# EAGLE design Root1 CR2032 Power Module (EAGLE 6.2)
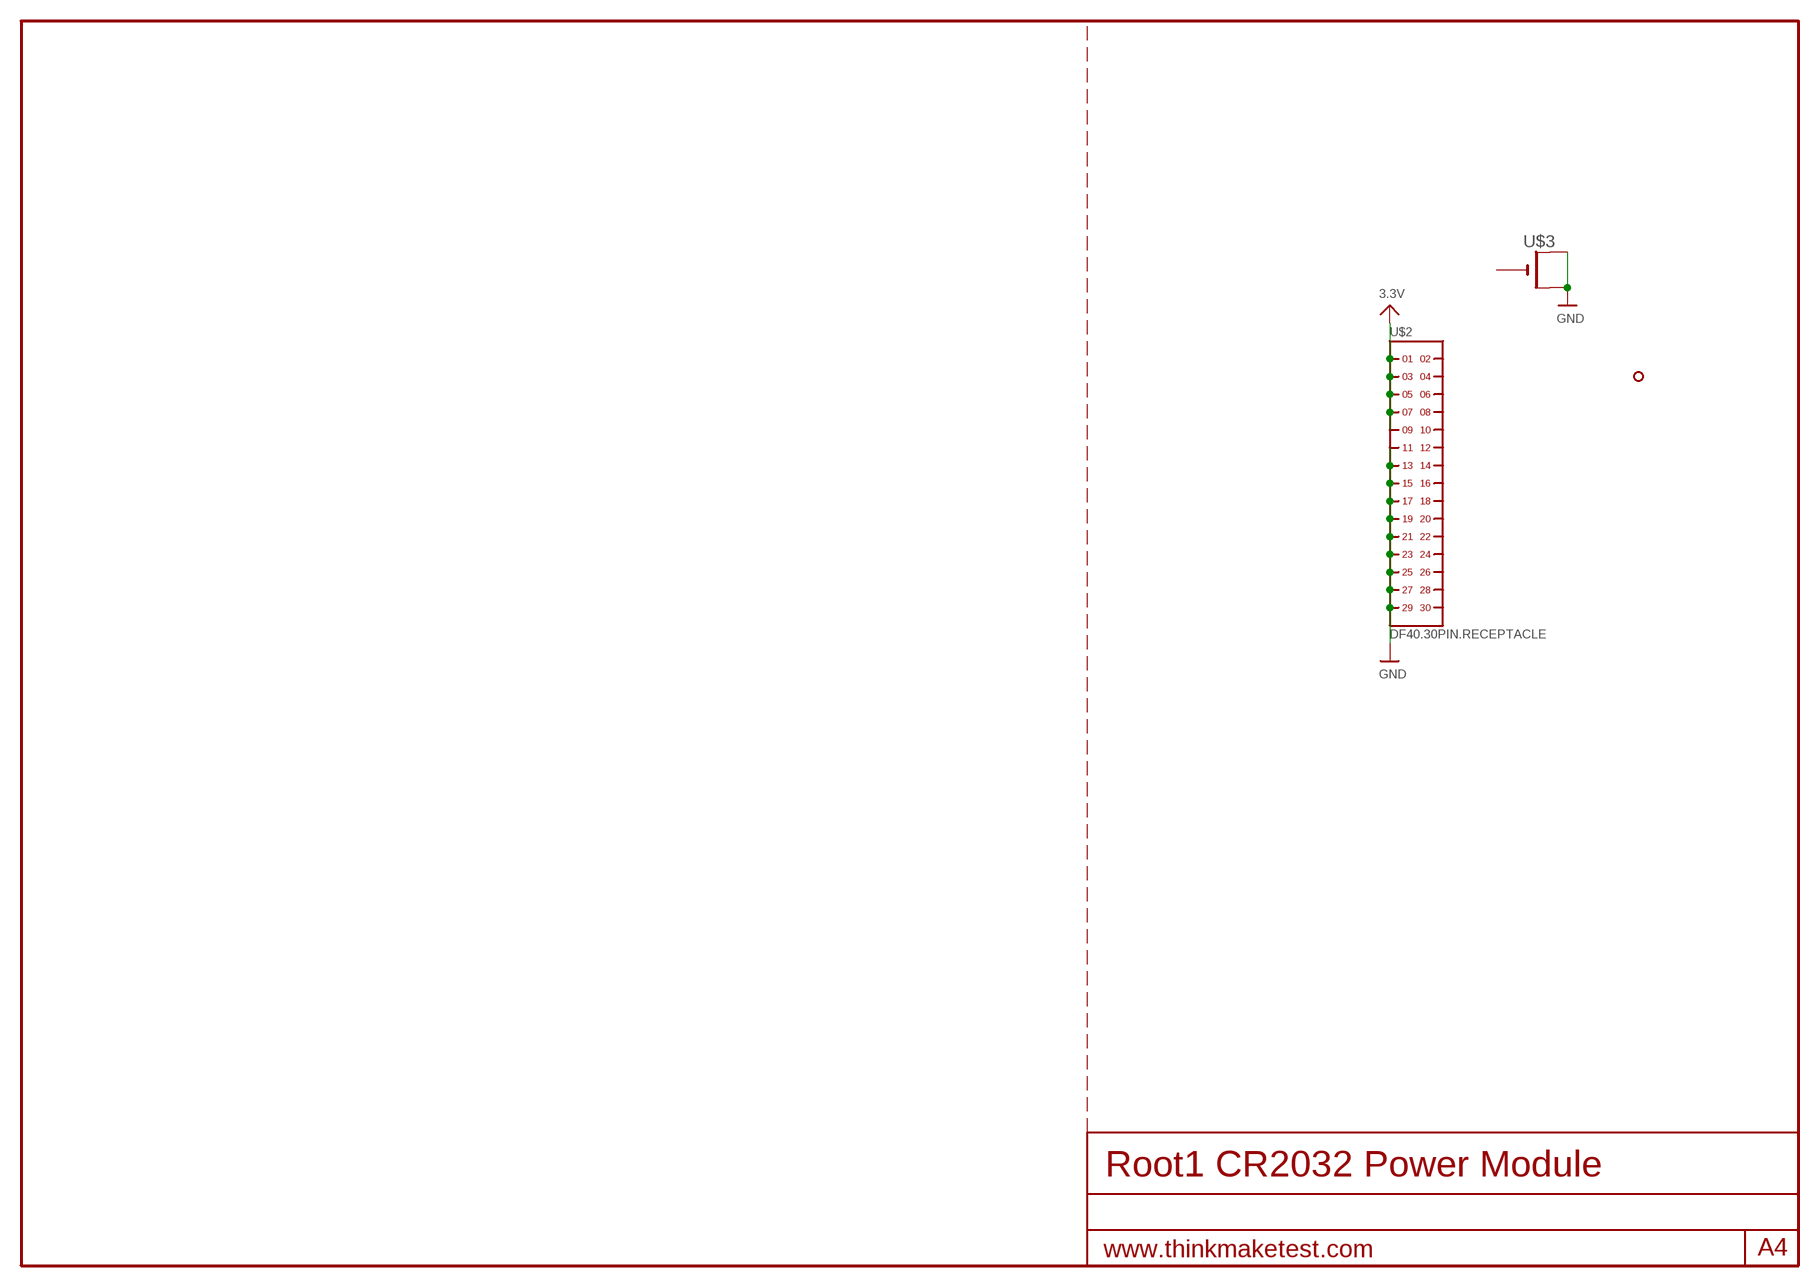
[diagram p0: schematic, sheet 1]

## Parts
U$2  DF40.30PIN.RECEPTACLE  [DF40(XX)-30DS-0.4V]
U$3  CR2032THM  [CR2032-THRU]
U$4  HOLE.4MM  [4MM]

## Nets
3.3V: U$2.1 U$2.3 U$2.5 U$2.7 U$2.9
GND: U$2.11 U$2.13 U$2.15 U$2.17 U$2.19 U$2.21 U$2.23 U$2.25 U$2.27 U$2.29 U$3.+1(+) U$3.+2(+1)
Unconnected: U$2.2 U$2.4 U$2.6 U$2.8 U$2.10 U$2.12 U$2.14 U$2.16 U$2.18 U$2.20 U$2.22 U$2.24 U$2.26 U$2.28 U$2.30 U$3.-

## Library data of the parts
U$2 = hirose:DF40.30PIN
U$3 = adafruit:CR2032
U$4 = .screw_holes:HOLE

## Board
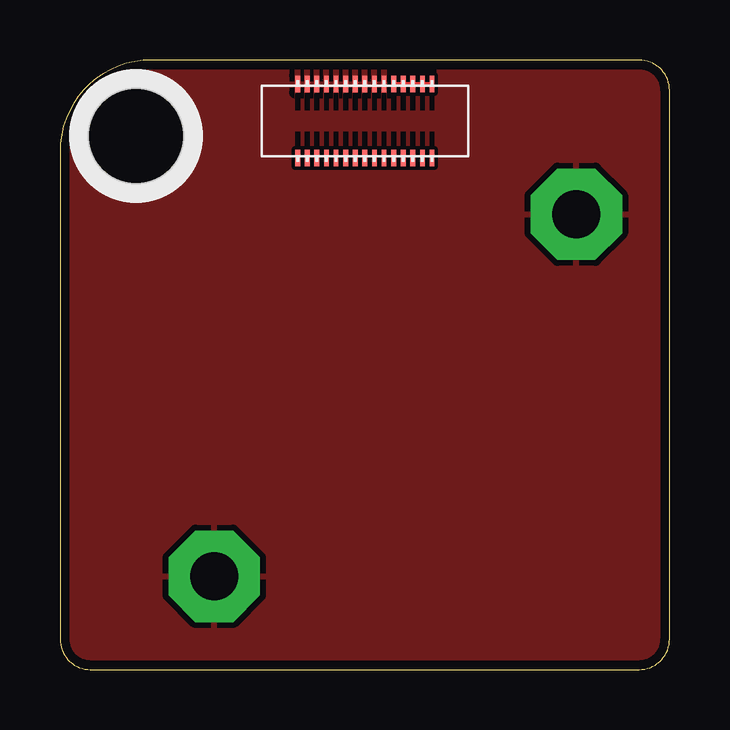
[diagram p1: board, top side]
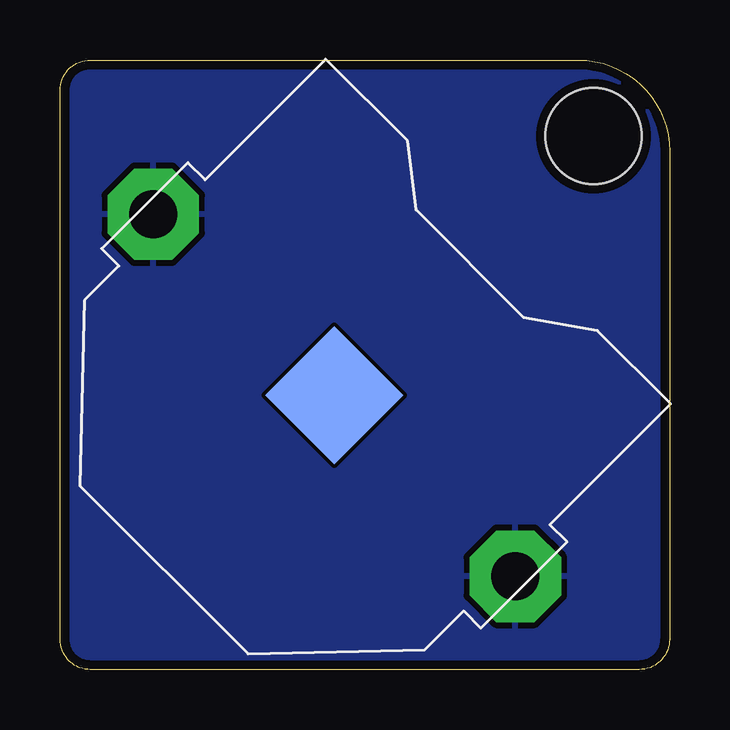
[diagram p2: board, bottom side, seen from below]

Size 25.4 x 25.4 mm. Coordinates in mm from the lower left corner, seen from the top.
Outline: 24.13,25.4 3.81,25.4 arc90 0,21.59 0,1.27 arc90 1.27,0 24.13,0 arc90 25.4,1.27 25.4,24.13 arc90 24.13,25.4
Copper layers (1*16): Top 0.0356mm / dielectric 1.5011mm / Bottom 0.0356mm
Design rules: minimum track width 6mil, minimum drill 13mil, track to track 6mil, track to pad 6mil, pad to pad 6mil, via to via 6mil, smd to smd 6mil, copper to edge 15mil, drill to drill 6mil, minimum pad ring 7mil, minimum via ring 7mil, stop-mask expansion 4mil, vias tented up to drill 16mil, thermal gap 10mil

### Footprints (pad centres in the part's own frame; a part is rotated, then mirrored left to right if it is on the bottom)
DF40(XX)-30DS-0.4V = smd 0.2 x 0.7: 1 -2.8,-1.54; 2 -2.8,1.54; 3 -2.4,-1.54; 4 -2.4,1.54; 5 -2,-1.54; 6 -2,1.54; 7 -1.6,-1.54; 8 -1.6,1.54; 9 -1.2,-1.54; 10 -1.2,1.54; 11 -0.8,-1.54; 12 -0.8,1.54; 13 -0.4,-1.54; 14 -0.4,1.54; 15 0,-1.54; 16 0,1.54; 17 0.4,-1.54; 18 0.4,1.54; 19 0.8,-1.54; 20 0.8,1.54; 21 1.2,-1.54; 22 1.2,1.54; 23 1.6,-1.54; 24 1.6,1.54; 25 2,-1.54; 26 2,1.54; 27 2.4,-1.54; 28 2.4,1.54; 29 2.8,-1.54; 30 2.8,1.54
CR2032-THRU = drill 2 pad 3.81 octagon: +1 -10.668,0; +2 10.668,0 | smd 4.064 x 4.064: - 0,0
4MM = hole 4: 0,0

### Placement (x,y rotation side)
U$2  12.7,22.86 180 top
U$3  13.97,11.43 315 bottom
U$4  3.17,22.23 0 top

### Tracks (layer width: path | path; a pad name or v marks a point on that pad's centre or on a via)
3.3V
  Top 0.203: U$2.9 U$2.7 U$2.5 U$2.3 U$2.1
GND
  pour Bottom: 24.13,25.4 3.81,25.4 arc90 0,21.59 0,1.27 arc90 1.27,0 24.13,0 arc90 25.4,1.27 25.4,24.13 arc90
  pour Top: 24.13,25.4 3.81,25.4 arc90 0,21.59 0,1.27 arc90 1.27,0 24.13,0 arc90 25.4,1.27 25.4,24.13 arc90